# EAGLE design Graphics Card Rev1 (EAGLE 9.1.3)
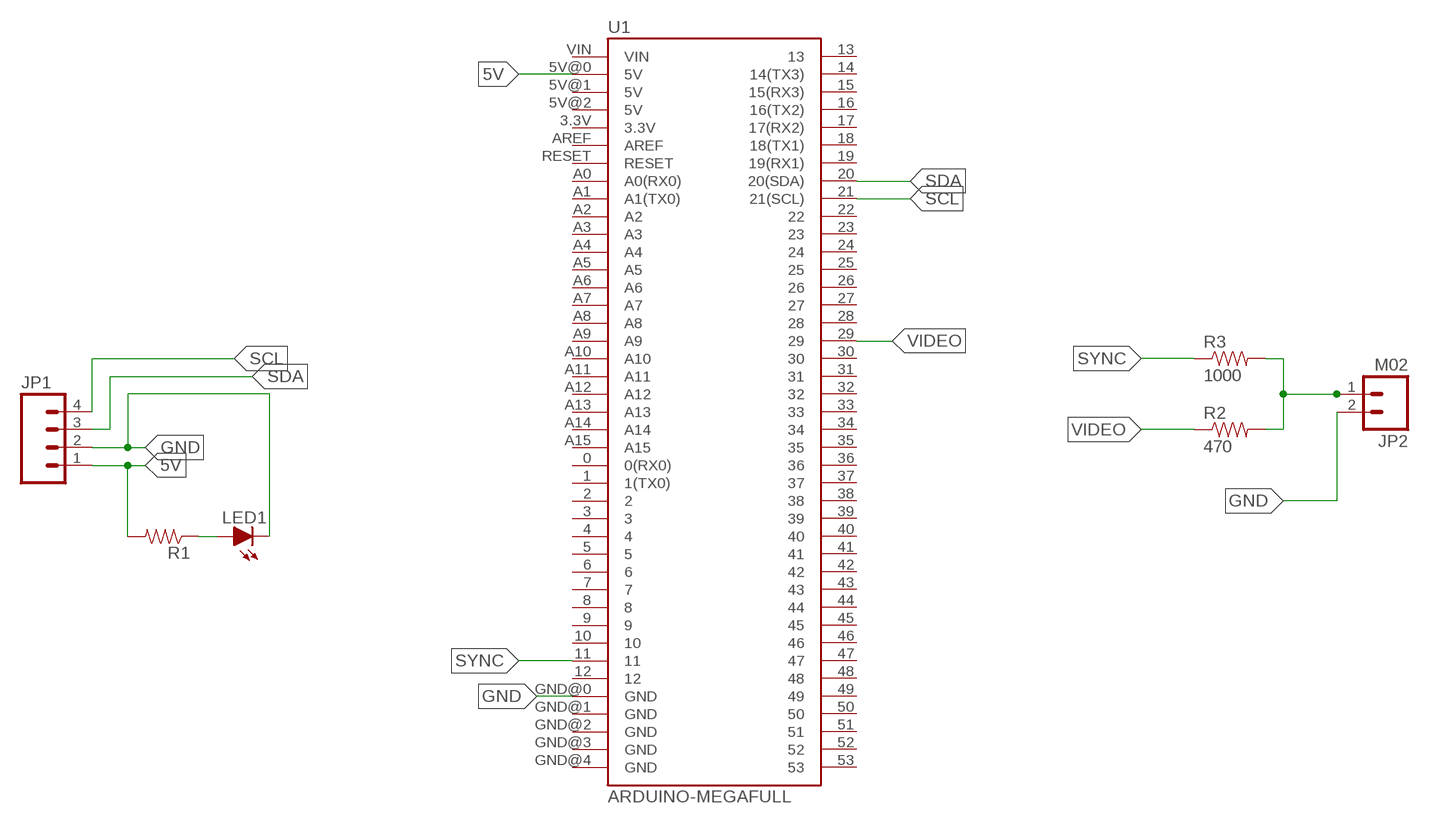
[diagram p0: schematic, sheet 1]

## Parts
JP1  M04  [1X04]
JP2  M02  [1X02]
LED1  LED-5MM  [LED-5MM]
R1  RESISTORPTH-1/2W  [AXIAL-0.5]
R2  470  RESISTORPTH-1/2W  [AXIAL-0.5]
R3  1000  RESISTORPTH-1/2W  [AXIAL-0.5]
U1  ARDUINO-MEGAFULL  [ARDUINO_MEGA]

## Nets
5V: JP1.1 R1.P$2 U1.5V@0(5V)
GND: JP1.2 JP2.2 LED1.K(C) U1.GND@0(GND)
N$1: LED1.A R1.P$1
N$4: JP2.1 R2.P$2 R3.P$2
SCL: JP1.4 U1.21(21(SCL))
SDA: JP1.3 U1.20(20(SDA))
SYNC: R3.P$1 U1.11
VIDEO: R2.P$1 U1.29
Unconnected: U1.0(0(RX0)) U1.1(1(TX0)) U1.2 U1.3 U1.3.3V U1.4 U1.5 U1.5V@1(5V) U1.5V@2(5V) U1.6 U1.7 U1.8 U1.9 U1.10 U1.12 U1.13 U1.14(14(TX3)) U1.15(15(RX3)) U1.16(16(TX2)) U1.17(17(RX2)) U1.18(18(TX1)) U1.19(19(RX1)) U1.22 U1.23 U1.24 U1.25 U1.26 U1.27 U1.28 U1.30 U1.31 U1.32 U1.33 U1.34 U1.35 U1.36 U1.37 U1.38 U1.39 U1.40 U1.41 U1.42 U1.43 U1.44 U1.45 U1.46 U1.47 U1.48 U1.49 U1.50 U1.51 U1.52 U1.53 U1.A0(A0(RX0)) U1.A1(A1(TX0)) U1.A2 U1.A3 U1.A4 U1.A5 U1.A6 U1.A7 U1.A8 U1.A9 U1.A10 U1.A11 U1.A12 U1.A13 U1.A14 U1.A15 U1.AREF U1.GND@1(GND) U1.GND@2(GND) U1.GND@3(GND) U1.GND@4(GND) U1.RESET U1.VIN

## Library data of the parts
JP1 = HyTechDevices:M04: Standard 4-pin 0.1" header. NOTES ON THE VARIANTS LOCK and LOCK_LONGPADS... This footprint was designed to help hold the alignment of a through-hole component (i.e. 6-pin header) while soldering it into place. You may notice that each hole has been shifted either up or down by 0.005 of an inch from it's more standard position (which is a perfectly straight line). This slight alteration caused the pins (the squares in the middle) to touch the edges of the holes. Because they are alternating, it causes a "brace" to hold the component in place. 0.005 has proven to be the perfect amount of "off-center" position when using our standard breakaway headers. Although looks a little odd when you look at the bare footprint, once you have a header in there, the alteration is very hard to notice. Also,if you push a header all the way into place, it is covered up entirely on the bottom side. This idea of altering the position of holes to aid alignment will be further integrated into the Sparkfun Library for other footprints. It can help hold any component with 3 or more connection pins. Note: The Sparkfun version includes many other packages including surface mount that may be of future interest. Source: Sparkfun <https://github.com/sparkfun/SparkFun-Eagle-Libraries>
JP2 = HyTechDevices:M02: Standard 2-pin 0.1" header. NOTES ON THE VARIANTS LOCK and LOCK_LONGPADS... This footprint was designed to help hold the alignment of a through-hole component (i.e. 6-pin header) while soldering it into place. You may notice that each hole has been shifted either up or down by 0.005 of an inch from it's more standard position (which is a perfectly straight line). This slight alteration caused the pins (the squares in the middle) to touch the edges of the holes. Because they are alternating, it causes a "brace" to hold the component in place. 0.005 has proven to be the perfect amount of "off-center" position when using our standard breakaway headers. Although looks a little odd when you look at the bare footprint, once you have a header in there, the alteration is very hard to notice. Also,if you push a header all the way into place, it is covered up entirely on the bottom side. This idea of altering the position of holes to aid alignment will be further integrated into the Sparkfun Library for other footprints. It can help hold any component with 3 or more connection pins. Note: The Sparkfun version includes many other packages including surface mount that may be of future interest. Source: Sparkfun <https://github.com/sparkfun/SparkFun-Eagle-Libraries>
LED1 = HyTechDevices:LED: Light Emitting Diode (LED) Source: Dangerous Prototypes Eagle Library <https://github.com/DangerousPrototypes/Eagle_Part_Library>
R1-R3 = HyTechDevices:RESISTOR: Resistor Basic schematic elements and footprints for 0603, 1206, and PTH resistors.
U1 = HyTechDevices:ARDUINO-MEGA: Arduino Mega board footprint Pinout Diagram <http://www.pighixxx.com/test/pinouts/boards/mega.pdf> Source: Sparkfun <https://github.com/sparkfun/SparkFun-Eagle-Libraries>

## Board
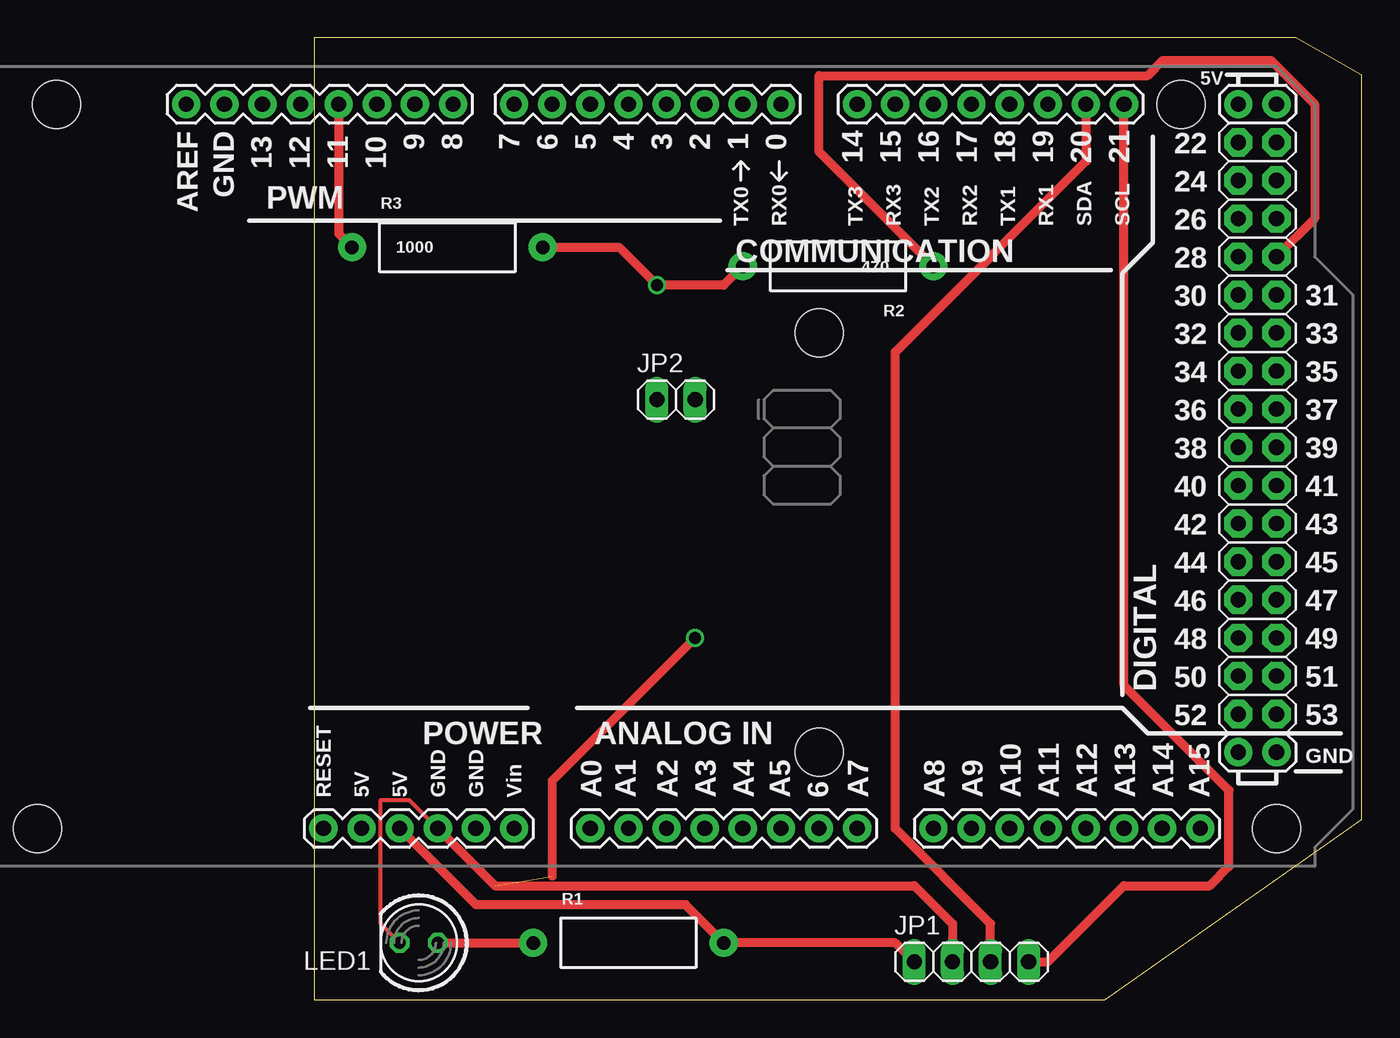
[diagram p1: board, top side]
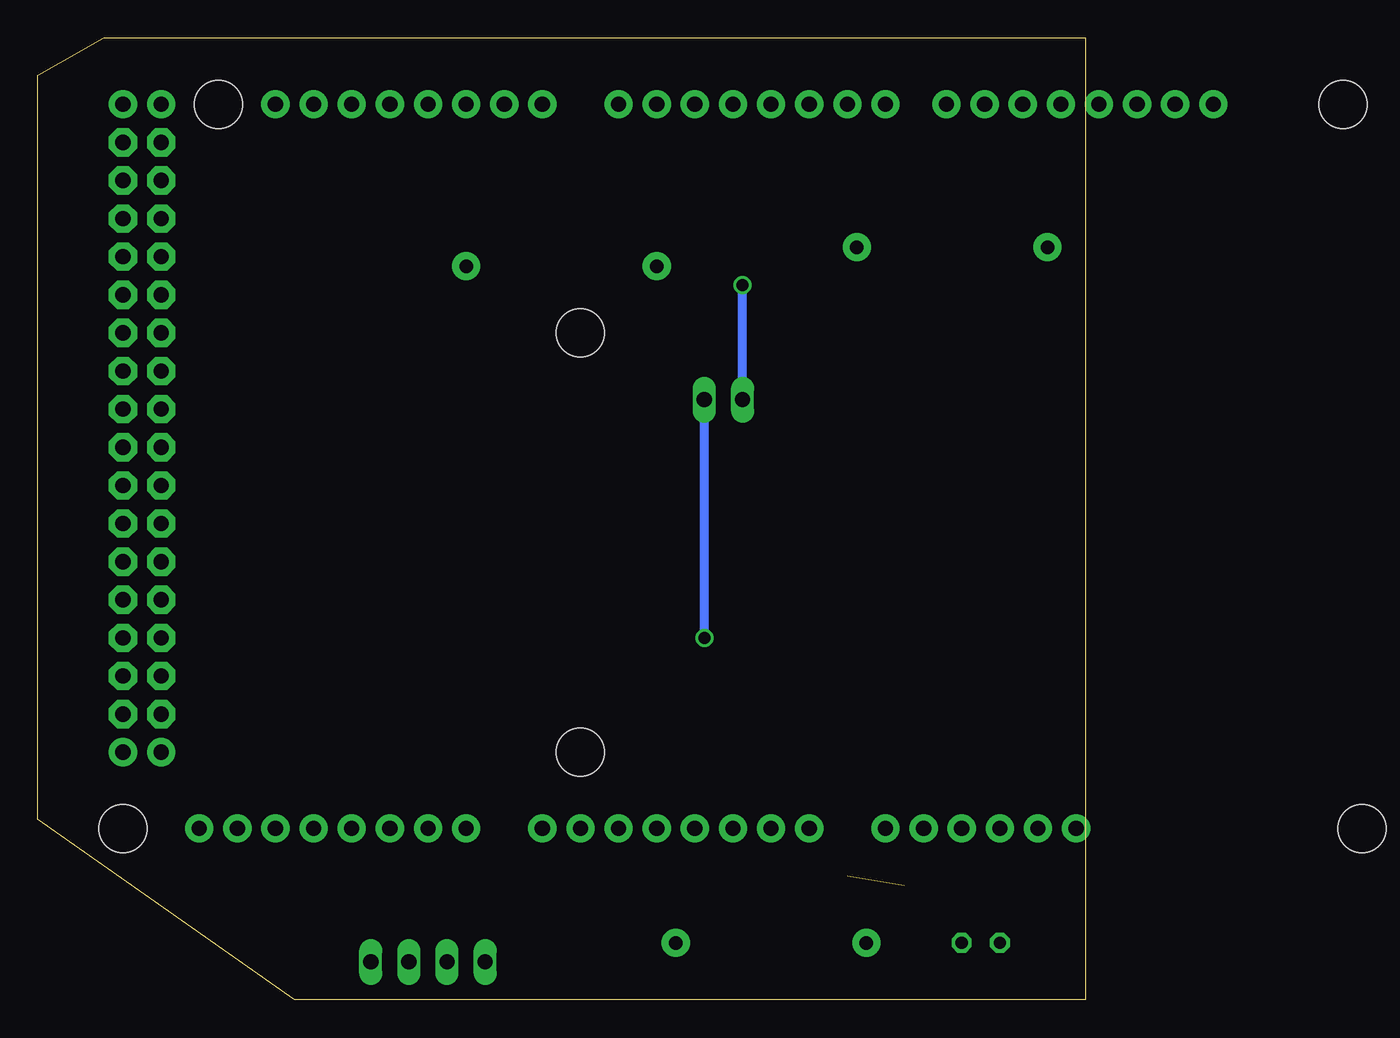
[diagram p2: board, bottom side, seen from below]

Size 69.83 x 64.14 mm. Coordinates in mm from the lower left corner, seen from the top.
Outline: 0,0 52.7,0 69.83,12.04 69.83,61.62 65.41,64.14 63.8,64.14 0,64.14 0,0
Copper layers (1*16): Top 0.035mm / dielectric 1.5mm / Bottom 0.035mm
Design rules "default": minimum track width 6mil, minimum drill 0.35mm, track to track 6mil, track to pad 6mil, pad to pad 6mil, via to via 6mil, smd to smd 6mil, copper to edge 40mil, drill to drill 6mil, minimum pad ring 10mil, minimum via ring 8mil, stop-mask expansion 4mil, vias tented up to drill 0mil, thermal gap 10mil

### Footprints (pad centres in the part's own frame; a part is rotated, then mirrored left to right if it is on the bottom)
1X04 = drill 1.016 long: 1 -3.81,0; 2 -1.27,0; 3 1.27,0; 4 3.81,0
1X02 = drill 1.016 long: 1 -1.27,0; 2 1.27,0
LED-5MM = drill 0.813 octagon: A -1.27,0; K 1.27,0
AXIAL-0.5 = drill 0.9 pad 1.88: P$1 -6.35,0; P$2 6.35,0
ARDUINO_MEGA = drill 1.016 pad 1.88: 0 63.5,50.8; 1 60.96,50.8; 2 58.42,50.8; 3 55.88,50.8; 3.3V 35.56,2.54; 4 53.34,50.8; 5 50.8,50.8; 5V@0 38.1,2.54; 5V@1 93.98,50.8; 5V@2 96.52,50.8; 6 48.26,50.8; 7 45.72,50.8; 8 41.656,50.8; 9 39.116,50.8; 10 36.576,50.8; 11 34.036,50.8; 12 31.496,50.8; 13 28.956,50.8; 14 68.58,50.8; 15 71.12,50.8; 16 73.66,50.8; 17 76.2,50.8; 18 78.74,50.8; 19 81.28,50.8; 20 83.82,50.8; 21 86.36,50.8; A0 50.8,2.54; A1 53.34,2.54; A2 55.88,2.54; A3 58.42,2.54; A4 60.96,2.54; A5 63.5,2.54; A6 66.04,2.54; A7 68.58,2.54; A8 73.66,2.54; A9 76.2,2.54; A10 78.74,2.54; A11 81.28,2.54; A12 83.82,2.54; A13 86.36,2.54; A14 88.9,2.54; A15 91.44,2.54; AREF 23.876,50.8; GND@0 40.64,2.54; GND@1 43.18,2.54; GND@2 93.98,7.62; GND@3 96.52,7.62; GND@4 26.416,50.8; RESET 33.02,2.54; VIN 45.72,2.54 | drill 1.016 pad 1.88 octagon: 22 93.98,48.26; 23 96.52,48.26; 24 93.98,45.72; 25 96.52,45.72; 26 93.98,43.18; 27 96.52,43.18; 28 93.98,40.64; 29 96.52,40.64; 30 93.98,38.1; 31 96.52,38.1; 32 93.98,35.56; 33 96.52,35.56; 34 93.98,33.02; 35 96.52,33.02; 36 93.98,30.48; 37 96.52,30.48; 38 93.98,27.94; 39 96.52,27.94; 40 93.98,25.4; 41 96.52,25.4; 42 93.98,22.86; 43 96.52,22.86; 44 93.98,20.32; 45 96.52,20.32; 46 93.98,17.78; 47 96.52,17.78; 48 93.98,15.24; 49 96.52,15.24; 50 93.98,12.7; 51 96.52,12.7; 52 93.98,10.16; 53 96.52,10.16 | hole 3.2: 15.24,50.8; 13.97,2.54; 66.04,35.56; 66.04,7.62; 90.17,50.8; 96.52,2.54

### Placement (x,y rotation side)
JP1  43.81,2.54 0 top
JP2  24.13,40 0 top
LED1  6.98,3.81 180 top
R1  20.96,3.81 0 top
R2  34.92,48.89 180 top
R3  8.89,50.16 0 top
U1  -32.39,8.89 0 top

### Tracks (layer width: path | path; a pad name or v marks a point on that pad's centre or on a via)
5V
  Top 0.61: JP1.1 38.73,3.81 R1.P$2 24.77,6.35 10.79,6.35 U1.5V@0
GND  (via drill 0.8)  (1 unrouted)
  Top 0.254: LED1.K 4.45,5.08 4.45,13.34 6.35,13.34 U1.GND@0
  Top 0.61: U1.GND@0 12.06,7.62 40,7.62 42.54,5.08 JP1.2 | v25.4,24.13 15.88,14.61 15.88,8.26
  Bottom 0.61: v25.4,24.13 JP2.2
N$1
  Top 0.61: LED1.A R1.P$1
N$4  (via drill 0.8)
  Top 0.61: R3.P$2 20.32,50.16 v22.86,47.62 27.31,47.62 R2.P$2
  Bottom 0.61: JP2.1 v22.86,47.62
SCL
  Top 0.61: JP1.4 48.89,2.54 53.98,7.62 59.69,7.62 60.96,8.89 60.96,13.97 53.98,20.95 U1.21
SDA
  Top 0.61: U1.20 51.43,55.88 38.73,43.18 38.73,11.43 45.09,5.08 JP1.3
SYNC
  Top 0.61: U1.11 1.65,51.05 R3.P$1
VIDEO
  Top 0.61: R2.P$1 33.66,56.52 33.66,61.59 55.56,61.59 56.57,62.61 63.75,62.61 66.68,59.69 66.68,52.07 U1.29